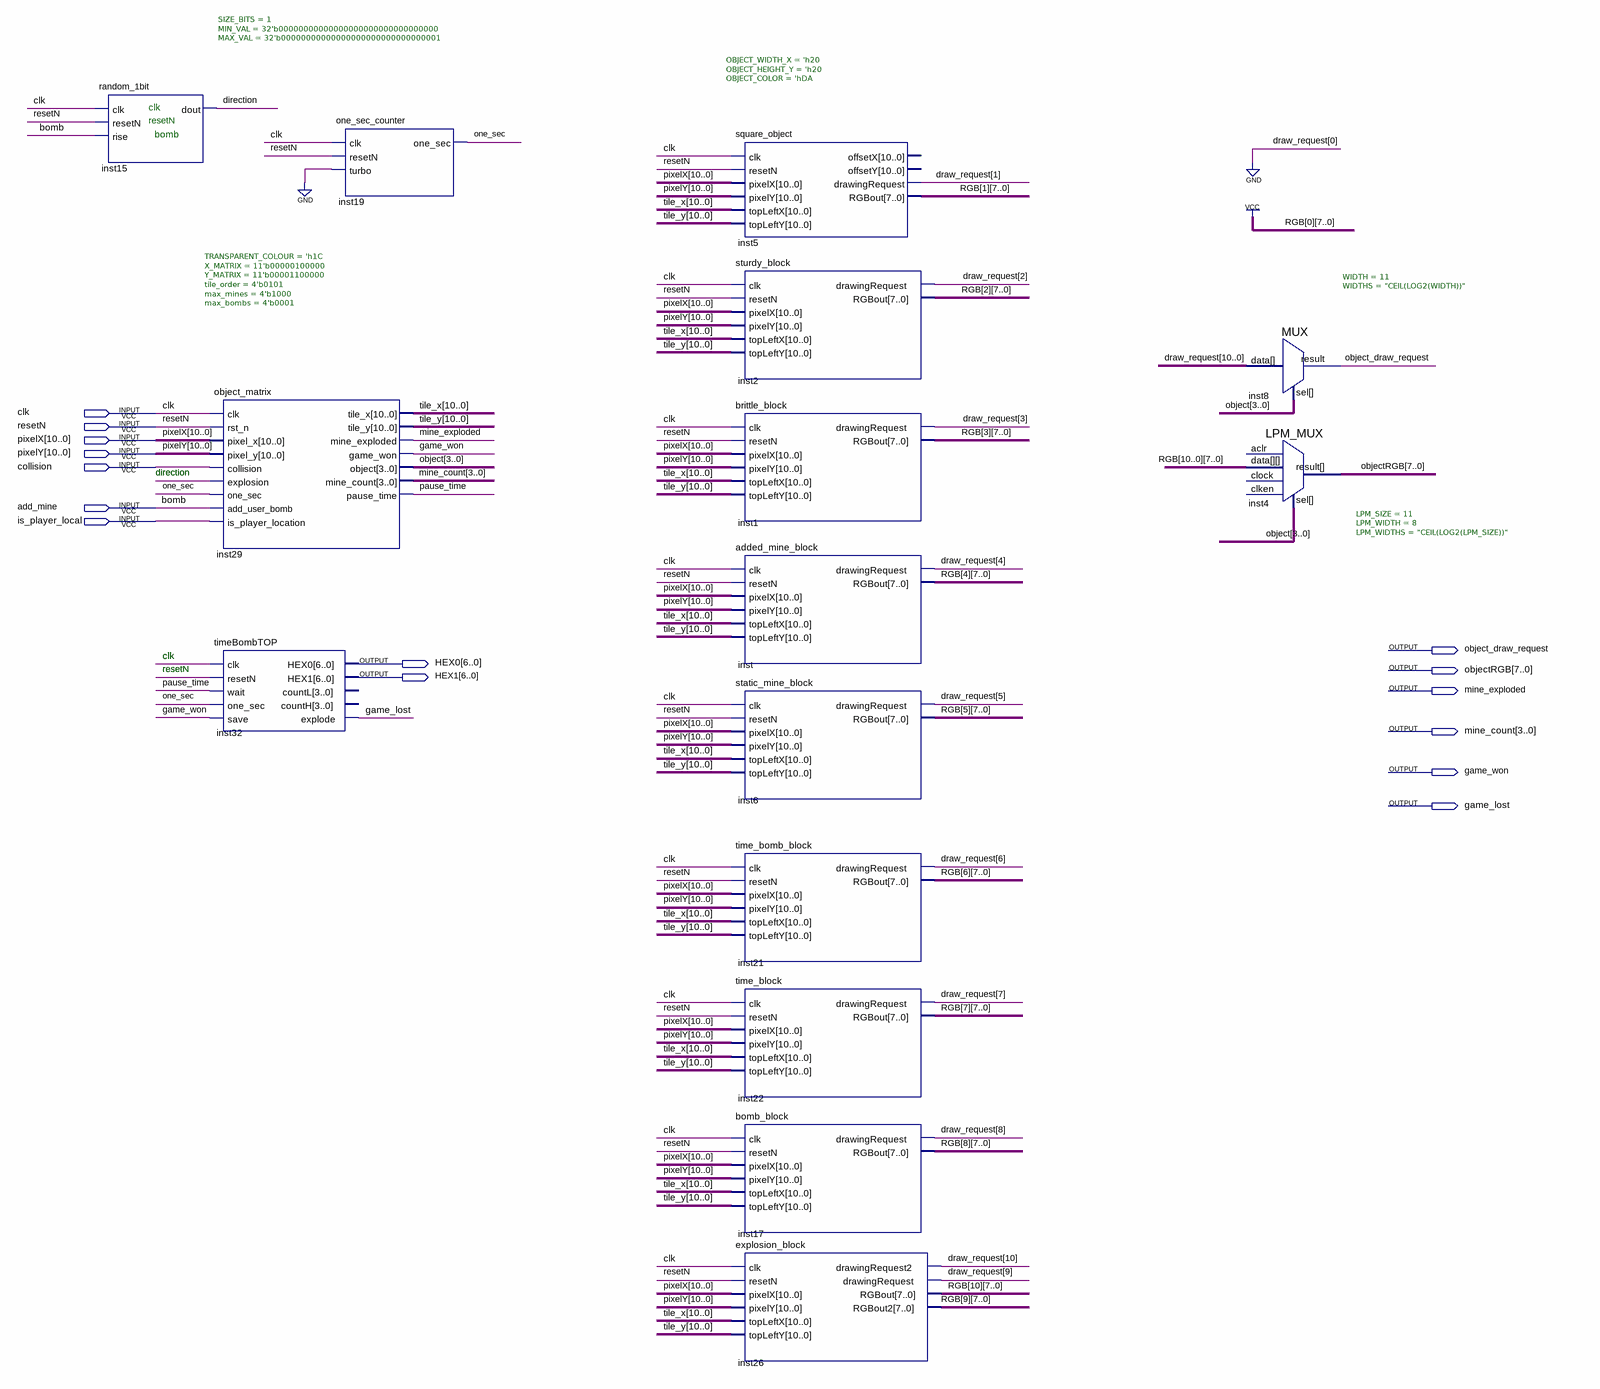
[diagram p0: schematic sheet]
// Quartus schematic objects.bdf as structural Verilog: 15 symbols, 15 pins
module objects (
  input  clk,
  input  resetN,
  input  [10:0] pixelX,
  input  [10:0] pixelY,
  input  collision,
  input  add_mine,
  input  is_player_local,
  output object_draw_request,
  output [6:0] HEX0,
  output [7:0] objectRGB,
  output [6:0] HEX1,
  output mine_exploded,
  output [3:0] mine_count,
  output game_won,
  output game_lost
);

  wire direction, one_sec, pause_time;
  wire [3:0] object;
  wire [7:0] RGB_1, RGB_2, RGB_3, RGB_4, RGB_5, RGB_6, RGB_7, RGB_8, RGB_9, RGB_10;
  wire [10:0] tile_x, tile_y;
  wire [10:1] draw_request;

  random_1bit #(.SIZE_BITS(1), .MIN_VAL(32'b00000000000000000000000000000000), .MAX_VAL(32'b00000000000000000000000000000001)) inst15 (
    .clk(clk), .resetN(resetN), .rise(add_mine), .dout(direction));
  object_matrix #(.TRANSPARENT_COLOUR('h1C), .X_MATRIX(11'b00000100000), .Y_MATRIX(11'b00001100000), .tile_order(4'b0101), .max_mines(4'b1000), .max_bombs(4'b0001)) inst29 (
    .clk(clk), .rst_n(resetN), .pixel_x(pixelX), .pixel_y(pixelY), .collision(collision),
    .explosion(direction), .one_sec(one_sec), .add_user_bomb(add_mine), .is_player_location(is_player_local),
    .tile_x(tile_x), .tile_y(tile_y), .mine_exploded(mine_exploded), .game_won(game_won), .object(object),
    .mine_count(mine_count), .pause_time(pause_time));
  timeBombTOP inst32 (
    .clk(clk), .resetN(resetN), .\wait (pause_time), .one_sec(one_sec), .save(game_won), .HEX0(HEX0),
    .HEX1(HEX1), .explode(game_lost));  // open: countL, countH
  one_sec_counter inst19 (.clk(clk), .resetN(resetN), .turbo(1'b0), .one_sec(one_sec));
  square_object #(.OBJECT_WIDTH_X('h20), .OBJECT_HEIGHT_Y('h20), .OBJECT_COLOR('hDA)) inst5 (
    .clk(clk), .resetN(resetN), .pixelX(pixelX), .pixelY(pixelY), .topLeftX(tile_x), .topLeftY(tile_y),
    .drawingRequest(draw_request[1]), .RGBout(RGB_1));  // open: offsetX, offsetY
  sturdy_block inst2 (
    .clk(clk), .resetN(resetN), .pixelX(pixelX), .pixelY(pixelY), .topLeftX(tile_x), .topLeftY(tile_y),
    .drawingRequest(draw_request[2]), .RGBout(RGB_2));
  brittle_block inst1 (
    .clk(clk), .resetN(resetN), .pixelX(pixelX), .pixelY(pixelY), .topLeftX(tile_x), .topLeftY(tile_y),
    .drawingRequest(draw_request[3]), .RGBout(RGB_3));
  added_mine_block inst (
    .clk(clk), .resetN(resetN), .pixelX(pixelX), .pixelY(pixelY), .topLeftX(tile_x), .topLeftY(tile_y),
    .drawingRequest(draw_request[4]), .RGBout(RGB_4));
  static_mine_block inst6 (
    .clk(clk), .resetN(resetN), .pixelX(pixelX), .pixelY(pixelY), .topLeftX(tile_x), .topLeftY(tile_y),
    .drawingRequest(draw_request[5]), .RGBout(RGB_5));
  time_bomb_block inst21 (
    .clk(clk), .resetN(resetN), .pixelX(pixelX), .pixelY(pixelY), .topLeftX(tile_x), .topLeftY(tile_y),
    .drawingRequest(draw_request[6]), .RGBout(RGB_6));
  time_block inst22 (
    .clk(clk), .resetN(resetN), .pixelX(pixelX), .pixelY(pixelY), .topLeftX(tile_x), .topLeftY(tile_y),
    .drawingRequest(draw_request[7]), .RGBout(RGB_7));
  bomb_block inst17 (
    .clk(clk), .resetN(resetN), .pixelX(pixelX), .pixelY(pixelY), .topLeftX(tile_x), .topLeftY(tile_y),
    .drawingRequest(draw_request[8]), .RGBout(RGB_8));
  explosion_block inst26 (
    .clk(clk), .resetN(resetN), .pixelX(pixelX), .pixelY(pixelY), .topLeftX(tile_x), .topLeftY(tile_y),
    .drawingRequest2(draw_request[10]), .drawingRequest(draw_request[9]), .RGBout(RGB_10), .RGBout2(RGB_9));
  MUX #(.WIDTH(11), .WIDTHS("CEIL(LOG2(WIDTH))")) inst8 (
    .data({draw_request, 1'b0}), .sel(object), .result(object_draw_request));
  LPM_MUX #(.LPM_SIZE(11), .LPM_WIDTH(8), .LPM_WIDTHS("CEIL(LOG2(LPM_SIZE))")) inst4 (
    .data({RGB_10, RGB_9, RGB_8, RGB_7, RGB_6, RGB_5, RGB_4, RGB_3, RGB_2, RGB_1, {8{1'b1}}}), .sel(object),
    .result(objectRGB));  // open: clock, aclr, clken

  // Other names for the same wires on the sheet: bomb = add_mine

  // Notes on the sheet:
  //   clk
  //   resetN
  //   bomb
  //   direction
  //   clk
  //   resetN
endmodule
